# Altium project panel.PrjPcb
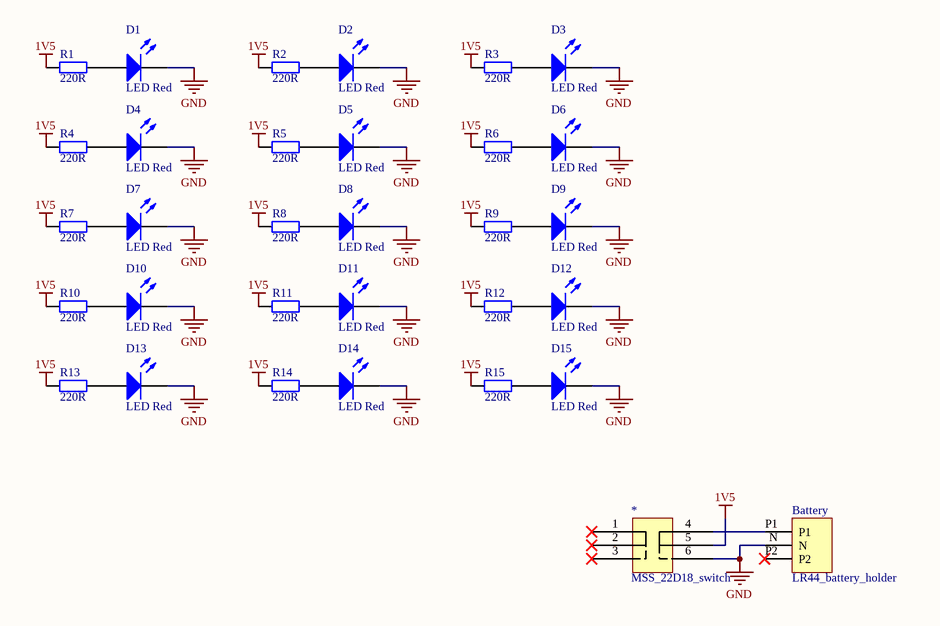
[diagram p0: panel.SchDoc]
1 sheet, 32 parts. Net scope: global (net labels, ports and power ports of the same name join across sheets).
Board file: panel.PcbDoc

## Sheet panel.SchDoc
size A

### Parts
*  MSS_22D18_switch  [MSS_22D18_switch]
Battery  LR44_battery_holder  [LR44_battery_holder]
D1  LED Red  [FP_0805_LED_RED]
D2  LED Red  [FP_0805_LED_RED]
D3  LED Red  [FP_0805_LED_RED]
D4  LED Red  [FP_0805_LED_RED]
D5  LED Red  [FP_0805_LED_RED]
D6  LED Red  [FP_0805_LED_RED]
D7  LED Red  [FP_0805_LED_RED]
D8  LED Red  [FP_0805_LED_RED]
D9  LED Red  [FP_0805_LED_RED]
D10  LED Red  [FP_0805_LED_RED]
D11  LED Red  [FP_0805_LED_RED]
D12  LED Red  [FP_0805_LED_RED]
D13  LED Red  [FP_0805_LED_RED]
D14  LED Red  [FP_0805_LED_RED]
D15  LED Red  [FP_0805_LED_RED]
R1  220R  [FP_0805_RES]
R2  220R  [FP_0805_RES]
R3  220R  [FP_0805_RES]
R4  220R  [FP_0805_RES]
R5  220R  [FP_0805_RES]
R6  220R  [FP_0805_RES]
R7  220R  [FP_0805_RES]
R8  220R  [FP_0805_RES]
R9  220R  [FP_0805_RES]
R10  220R  [FP_0805_RES]
R11  220R  [FP_0805_RES]
R12  220R  [FP_0805_RES]
R13  220R  [FP_0805_RES]
R14  220R  [FP_0805_RES]
R15  220R  [FP_0805_RES]

### Nets
1V5: *.5 R1.1 R2.1 R3.1 R4.1 R5.1 R6.1 R7.1 R8.1 R9.1 R10.1 R11.1 R12.1 R13.1 R14.1 R15.1
GND: *.6 Battery.N D1.2(K) D2.2(K) D3.2(K) D4.2(K) D5.2(K) D6.2(K) D7.2(K) D8.2(K) D9.2(K) D10.2(K) D11.2(K) D12.2(K) D13.2(K) D14.2(K) D15.2(K)
Net*_4: *.4 Battery.P1
NetD1_1: D1.1(A) R1.2
NetD2_1: D2.1(A) R2.2
NetD3_1: D3.1(A) R3.2
NetD4_1: D4.1(A) R4.2
NetD5_1: D5.1(A) R5.2
NetD6_1: D6.1(A) R6.2
NetD7_1: D7.1(A) R7.2
NetD8_1: D8.1(A) R8.2
NetD9_1: D9.1(A) R9.2
NetD10_1: D10.1(A) R10.2
NetD11_1: D11.1(A) R11.2
NetD12_1: D12.1(A) R12.2
NetD13_1: D13.1(A) R13.2
NetD14_1: D14.1(A) R14.2
NetD15_1: D15.1(A) R15.2

Not connected (* = marked no-connect by the designer): * 1* 2* 3*; Battery P2*

### Library data of the parts
D1-D15 = LED Red: Red LED; pin to pad: 1>A 2>K; U_fw: 1.85V; I_max: 20mA; Reference: 1581239; Name: MULTICOMP  MCL-S270SRC  LED, Red, SMD, 1.25mm x 1.4mm, 20 mA, 1.85 V, 643 nm; Wavelength: 643nm; Supplier: Farnell
R1-R15 = RES 220R: Resistor; Tolerance: 5%; Power: 125mW; Name: YAGEO (PHYCOMP)  RC0805JR-07220RL  SMD Chip Resistor, Thick Film, 220 ohm; Reference: 9233920; Supplier: Farnell; Value: 220R